# Altium schematic sheet ftdi_eeprom.SchDoc: Test
size A4; DrawnBy: Łukasz Przeniosło; Organization: Zachodniopomorski; Address1: Uniwersytet Technologiczny; Address2: w Szczecinie; Address3: Wydział Elektryczny; DocumentNumber: 7; Revision: 1.0; SheetNumber: 7; SheetTotal: 8
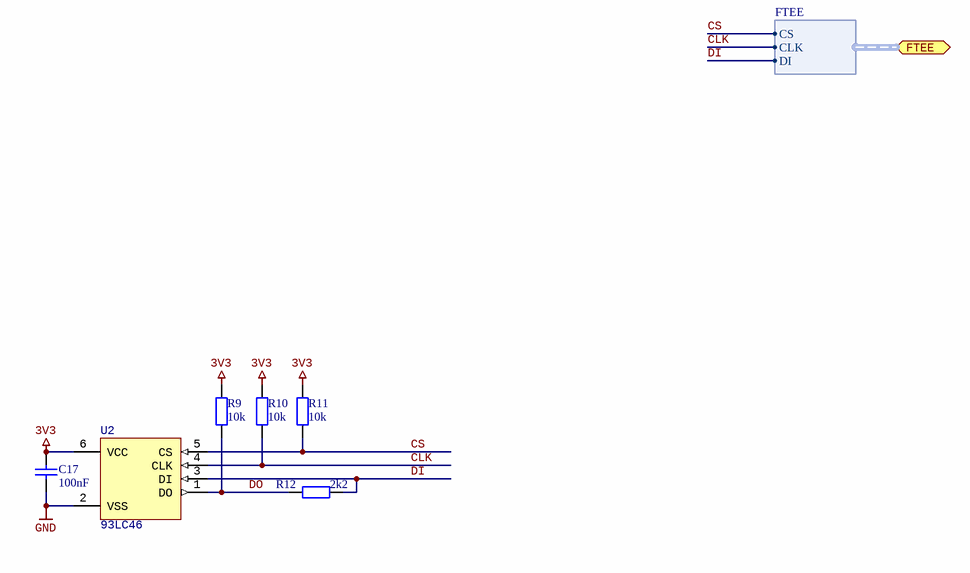
[diagram p0: ftdi_eeprom.SchDoc]

## Parts
C17  100nF  [CAPC1608N]
R9  10k  [RESC1608N]
R10  10k  [RESC1608N]
R11  10k  [RESC1608N]
R12  2k2  [RESC1608N]
U2  93LC46  [SOT23-6]

## Ports
FTEE (harness FTEE)

## Harnesses
FTEE: CS, CLK, DI

## Nets
3V3: C17.2 R9.1 R10.1 R11.1 U2.6(VCC)
GND: C17.1 U2.2(VSS)
CLK: R10.2 U2.4(CLK) ; port FTEE.CLK
CS: R11.2 U2.5(CS) ; port FTEE.CS
DI: R12.2 U2.3(DI) ; port FTEE.DI
DO: R9.2 R12.1 U2.1(DO)

## Notes on the sheet
- Title
- Size:
- Date:
- A4
- Author:
- Time:
- Sheet
- of
- File:

## Library data of the parts
C17 = Capacitor: Value: 100nF
R9-R12 = Resistor: Tolerance: 1%; Power: 0W
  R9-R11: Value: 10k
  R12: Value: 2k2
U2 = 93LC46: 1K Microwire Compatible Serial EEPROM